# Altium schematic sheet MODULE_GND.SchDoc: MODULE GND
size A3; Author: Silvio Navaretti; CompanyName: ARDUINO; DrawnBy: Silvio Navaretti; Engineer: Silvio Navaretti; Organization: ARDUINO; SheetNumber: 10; SheetTotal: 51; RevAuthor: Silvio Navaretti
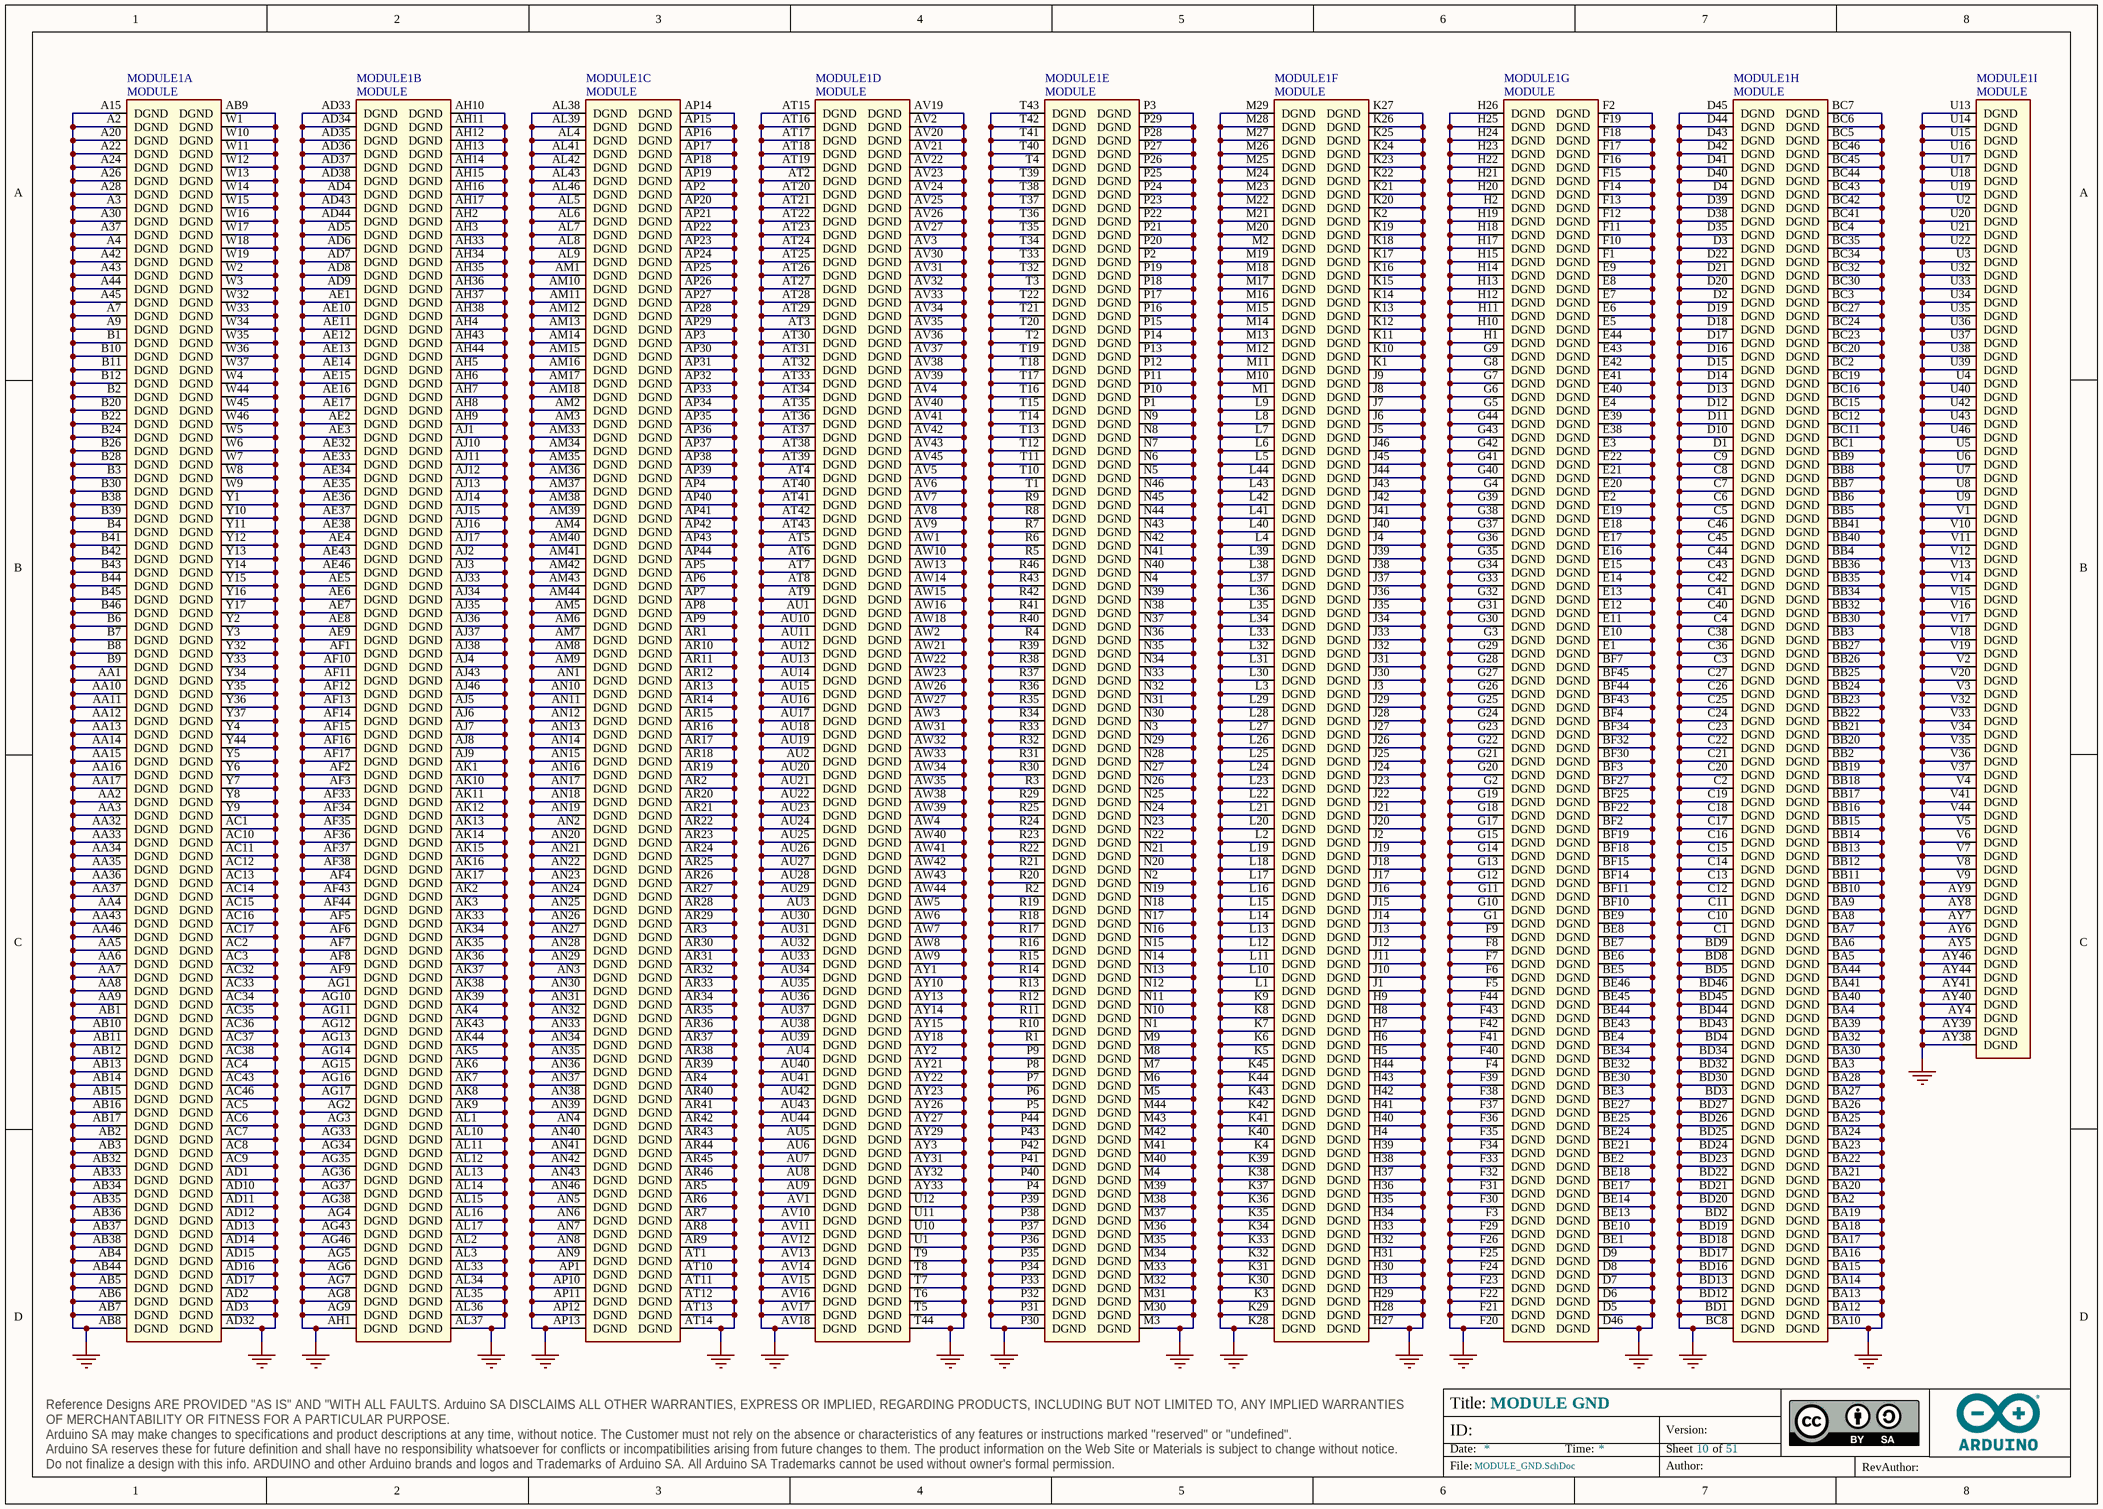
[diagram p0: MODULE_GND.SchDoc]

## Parts
MODULE1  MODULE  [MODULE]  (parts A,B,C,D,E,F,G,H,I of 22)

## Nets
GND: MODULE1.A2(DGND) MODULE1.A3(DGND) MODULE1.A4(DGND) MODULE1.A7(DGND) MODULE1.A9(DGND) MODULE1.A15(DGND) MODULE1.A20(DGND) MODULE1.A22(DGND) MODULE1.A24(DGND) MODULE1.A26(DGND) MODULE1.A28(DGND) MODULE1.A30(DGND) MODULE1.A37(DGND) MODULE1.A42(DGND) MODULE1.A43(DGND) MODULE1.A44(DGND) MODULE1.A45(DGND) MODULE1.AA1(DGND) MODULE1.AA2(DGND) MODULE1.AA3(DGND) MODULE1.AA4(DGND) MODULE1.AA5(DGND) MODULE1.AA6(DGND) MODULE1.AA7(DGND) MODULE1.AA8(DGND) MODULE1.AA9(DGND) MODULE1.AA10(DGND) MODULE1.AA11(DGND) MODULE1.AA12(DGND) MODULE1.AA13(DGND) MODULE1.AA14(DGND) MODULE1.AA15(DGND) MODULE1.AA16(DGND) MODULE1.AA17(DGND) MODULE1.AA32(DGND) MODULE1.AA33(DGND) MODULE1.AA34(DGND) MODULE1.AA35(DGND) MODULE1.AA36(DGND) MODULE1.AA37(DGND) MODULE1.AA43(DGND) MODULE1.AA46(DGND) MODULE1.AB1(DGND) MODULE1.AB2(DGND) MODULE1.AB3(DGND) MODULE1.AB4(DGND) MODULE1.AB5(DGND) MODULE1.AB6(DGND) MODULE1.AB7(DGND) MODULE1.AB8(DGND) MODULE1.AB9(DGND) MODULE1.AB10(DGND) MODULE1.AB11(DGND) MODULE1.AB12(DGND) MODULE1.AB13(DGND) MODULE1.AB14(DGND) MODULE1.AB15(DGND) MODULE1.AB16(DGND) MODULE1.AB17(DGND) MODULE1.AB32(DGND) MODULE1.AB33(DGND) MODULE1.AB34(DGND) MODULE1.AB35(DGND) MODULE1.AB36(DGND) MODULE1.AB37(DGND) MODULE1.AB38(DGND) MODULE1.AB44(DGND) MODULE1.AC1(DGND) MODULE1.AC2(DGND) MODULE1.AC3(DGND) MODULE1.AC4(DGND) MODULE1.AC5(DGND) MODULE1.AC6(DGND) MODULE1.AC7(DGND) MODULE1.AC8(DGND) MODULE1.AC9(DGND) MODULE1.AC10(DGND) MODULE1.AC11(DGND) MODULE1.AC12(DGND) MODULE1.AC13(DGND) MODULE1.AC14(DGND) MODULE1.AC15(DGND) MODULE1.AC16(DGND) MODULE1.AC17(DGND) MODULE1.AC32(DGND) MODULE1.AC33(DGND) MODULE1.AC34(DGND) MODULE1.AC35(DGND) MODULE1.AC36(DGND) MODULE1.AC37(DGND) MODULE1.AC38(DGND) MODULE1.AC43(DGND) MODULE1.AC46(DGND) MODULE1.AD1(DGND) MODULE1.AD2(DGND) MODULE1.AD3(DGND) MODULE1.AD4(DGND) MODULE1.AD5(DGND) MODULE1.AD6(DGND) MODULE1.AD7(DGND) MODULE1.AD8(DGND) MODULE1.AD9(DGND) MODULE1.AD10(DGND) MODULE1.AD11(DGND) MODULE1.AD12(DGND) MODULE1.AD13(DGND) MODULE1.AD14(DGND) MODULE1.AD15(DGND) MODULE1.AD16(DGND) MODULE1.AD17(DGND) MODULE1.AD32(DGND) MODULE1.AD33(DGND) MODULE1.AD34(DGND) MODULE1.AD35(DGND) MODULE1.AD36(DGND) MODULE1.AD37(DGND) MODULE1.AD38(DGND) MODULE1.AD43(DGND) MODULE1.AD44(DGND) MODULE1.AE1(DGND) MODULE1.AE2(DGND) MODULE1.AE3(DGND) MODULE1.AE4(DGND) MODULE1.AE5(DGND) MODULE1.AE6(DGND) MODULE1.AE7(DGND) MODULE1.AE8(DGND) MODULE1.AE9(DGND) MODULE1.AE10(DGND) MODULE1.AE11(DGND) MODULE1.AE12(DGND) MODULE1.AE13(DGND) MODULE1.AE14(DGND) MODULE1.AE15(DGND) MODULE1.AE16(DGND) MODULE1.AE17(DGND) MODULE1.AE32(DGND) MODULE1.AE33(DGND) MODULE1.AE34(DGND) MODULE1.AE35(DGND) MODULE1.AE36(DGND) MODULE1.AE37(DGND) MODULE1.AE38(DGND) MODULE1.AE43(DGND) MODULE1.AE46(DGND) MODULE1.AF1(DGND) MODULE1.AF2(DGND) MODULE1.AF3(DGND) MODULE1.AF4(DGND) MODULE1.AF5(DGND) MODULE1.AF6(DGND) MODULE1.AF7(DGND) MODULE1.AF8(DGND) MODULE1.AF9(DGND) MODULE1.AF10(DGND) MODULE1.AF11(DGND) MODULE1.AF12(DGND) MODULE1.AF13(DGND) MODULE1.AF14(DGND) MODULE1.AF15(DGND) MODULE1.AF16(DGND) MODULE1.AF17(DGND) MODULE1.AF33(DGND) MODULE1.AF34(DGND) MODULE1.AF35(DGND) MODULE1.AF36(DGND) MODULE1.AF37(DGND) MODULE1.AF38(DGND) MODULE1.AF43(DGND) MODULE1.AF44(DGND) MODULE1.AG1(DGND) MODULE1.AG2(DGND) MODULE1.AG3(DGND) MODULE1.AG4(DGND) MODULE1.AG5(DGND) MODULE1.AG6(DGND) MODULE1.AG7(DGND) MODULE1.AG8(DGND) MODULE1.AG9(DGND) MODULE1.AG10(DGND) MODULE1.AG11(DGND) MODULE1.AG12(DGND) MODULE1.AG13(DGND) MODULE1.AG14(DGND) MODULE1.AG15(DGND) MODULE1.AG16(DGND) MODULE1.AG17(DGND) MODULE1.AG33(DGND) MODULE1.AG34(DGND) MODULE1.AG35(DGND) MODULE1.AG36(DGND) MODULE1.AG37(DGND) MODULE1.AG38(DGND) MODULE1.AG43(DGND) MODULE1.AG46(DGND) MODULE1.AH1(DGND) MODULE1.AH2(DGND) MODULE1.AH3(DGND) MODULE1.AH4(DGND) MODULE1.AH5(DGND) MODULE1.AH6(DGND) MODULE1.AH7(DGND) MODULE1.AH8(DGND) MODULE1.AH9(DGND) MODULE1.AH10(DGND) MODULE1.AH11(DGND) MODULE1.AH12(DGND) MODULE1.AH13(DGND) MODULE1.AH14(DGND) MODULE1.AH15(DGND) MODULE1.AH16(DGND) MODULE1.AH17(DGND) MODULE1.AH33(DGND) MODULE1.AH34(DGND) MODULE1.AH35(DGND) MODULE1.AH36(DGND) MODULE1.AH37(DGND) MODULE1.AH38(DGND) MODULE1.AH43(DGND) MODULE1.AH44(DGND) MODULE1.AJ1(DGND) MODULE1.AJ2(DGND) MODULE1.AJ3(DGND) MODULE1.AJ4(DGND) MODULE1.AJ5(DGND) MODULE1.AJ6(DGND) MODULE1.AJ7(DGND) MODULE1.AJ8(DGND) MODULE1.AJ9(DGND) MODULE1.AJ10(DGND) MODULE1.AJ11(DGND) MODULE1.AJ12(DGND) MODULE1.AJ13(DGND) MODULE1.AJ14(DGND) MODULE1.AJ15(DGND) MODULE1.AJ16(DGND) MODULE1.AJ17(DGND) MODULE1.AJ33(DGND) MODULE1.AJ34(DGND) MODULE1.AJ35(DGND) MODULE1.AJ36(DGND) MODULE1.AJ37(DGND) MODULE1.AJ38(DGND) MODULE1.AJ43(DGND) MODULE1.AJ46(DGND) MODULE1.AK1(DGND) MODULE1.AK2(DGND) MODULE1.AK3(DGND) MODULE1.AK4(DGND) MODULE1.AK5(DGND) MODULE1.AK6(DGND) MODULE1.AK7(DGND) MODULE1.AK8(DGND) MODULE1.AK9(DGND) MODULE1.AK10(DGND) MODULE1.AK11(DGND) MODULE1.AK12(DGND) MODULE1.AK13(DGND) MODULE1.AK14(DGND) MODULE1.AK15(DGND) MODULE1.AK16(DGND) MODULE1.AK17(DGND) MODULE1.AK33(DGND) MODULE1.AK34(DGND) MODULE1.AK35(DGND) MODULE1.AK36(DGND) MODULE1.AK37(DGND) MODULE1.AK38(DGND) MODULE1.AK39(DGND) MODULE1.AK43(DGND) MODULE1.AK44(DGND) MODULE1.AL1(DGND) MODULE1.AL2(DGND) MODULE1.AL3(DGND) MODULE1.AL4(DGND) MODULE1.AL5(DGND) MODULE1.AL6(DGND) MODULE1.AL7(DGND) MODULE1.AL8(DGND) MODULE1.AL9(DGND) MODULE1.AL10(DGND) MODULE1.AL11(DGND) MODULE1.AL12(DGND) MODULE1.AL13(DGND) MODULE1.AL14(DGND) MODULE1.AL15(DGND) MODULE1.AL16(DGND) MODULE1.AL17(DGND) MODULE1.AL33(DGND) MODULE1.AL34(DGND) MODULE1.AL35(DGND) MODULE1.AL36(DGND) MODULE1.AL37(DGND) MODULE1.AL38(DGND) MODULE1.AL39(DGND) MODULE1.AL41(DGND) MODULE1.AL42(DGND) MODULE1.AL43(DGND) MODULE1.AL46(DGND) MODULE1.AM1(DGND) MODULE1.AM2(DGND) MODULE1.AM3(DGND) MODULE1.AM4(DGND) MODULE1.AM5(DGND) MODULE1.AM6(DGND) MODULE1.AM7(DGND) MODULE1.AM8(DGND) MODULE1.AM9(DGND) MODULE1.AM10(DGND) MODULE1.AM11(DGND) MODULE1.AM12(DGND) MODULE1.AM13(DGND) MODULE1.AM14(DGND) MODULE1.AM15(DGND) MODULE1.AM16(DGND) MODULE1.AM17(DGND) MODULE1.AM18(DGND) MODULE1.AM33(DGND) MODULE1.AM34(DGND) MODULE1.AM35(DGND) MODULE1.AM36(DGND) MODULE1.AM37(DGND) MODULE1.AM38(DGND) MODULE1.AM39(DGND) MODULE1.AM40(DGND) MODULE1.AM41(DGND) MODULE1.AM42(DGND) MODULE1.AM43(DGND) MODULE1.AM44(DGND) MODULE1.AN1(DGND) MODULE1.AN2(DGND) MODULE1.AN3(DGND) MODULE1.AN4(DGND) MODULE1.AN5(DGND) MODULE1.AN6(DGND) MODULE1.AN7(DGND) MODULE1.AN8(DGND) MODULE1.AN9(DGND) MODULE1.AN10(DGND) MODULE1.AN11(DGND) MODULE1.AN12(DGND) MODULE1.AN13(DGND) MODULE1.AN14(DGND) MODULE1.AN15(DGND) MODULE1.AN16(DGND) MODULE1.AN17(DGND) MODULE1.AN18(DGND) MODULE1.AN19(DGND) MODULE1.AN20(DGND) MODULE1.AN21(DGND) MODULE1.AN22(DGND) MODULE1.AN23(DGND) MODULE1.AN24(DGND) MODULE1.AN25(DGND) MODULE1.AN26(DGND) MODULE1.AN27(DGND) MODULE1.AN28(DGND) MODULE1.AN29(DGND) MODULE1.AN30(DGND) MODULE1.AN31(DGND) MODULE1.AN32(DGND) MODULE1.AN33(DGND) MODULE1.AN34(DGND) MODULE1.AN35(DGND) MODULE1.AN36(DGND) MODULE1.AN37(DGND) MODULE1.AN38(DGND) MODULE1.AN39(DGND) MODULE1.AN40(DGND) MODULE1.AN41(DGND) MODULE1.AN42(DGND) MODULE1.AN43(DGND) MODULE1.AN46(DGND) MODULE1.AP1(DGND) MODULE1.AP2(DGND) MODULE1.AP3(DGND) MODULE1.AP4(DGND) MODULE1.AP5(DGND) MODULE1.AP6(DGND) MODULE1.AP7(DGND) MODULE1.AP8(DGND) MODULE1.AP9(DGND) MODULE1.AP10(DGND) MODULE1.AP11(DGND) MODULE1.AP12(DGND) MODULE1.AP13(DGND) MODULE1.AP14(DGND) MODULE1.AP15(DGND) MODULE1.AP16(DGND) MODULE1.AP17(DGND) MODULE1.AP18(DGND) MODULE1.AP19(DGND) MODULE1.AP20(DGND) MODULE1.AP21(DGND) MODULE1.AP22(DGND) MODULE1.AP23(DGND) MODULE1.AP24(DGND) MODULE1.AP25(DGND) MODULE1.AP26(DGND) MODULE1.AP27(DGND) MODULE1.AP28(DGND) MODULE1.AP29(DGND) MODULE1.AP30(DGND) MODULE1.AP31(DGND) MODULE1.AP32(DGND) MODULE1.AP33(DGND) MODULE1.AP34(DGND) MODULE1.AP35(DGND) MODULE1.AP36(DGND) MODULE1.AP37(DGND) MODULE1.AP38(DGND) MODULE1.AP39(DGND) MODULE1.AP40(DGND) MODULE1.AP41(DGND) MODULE1.AP42(DGND) MODULE1.AP43(DGND) MODULE1.AP44(DGND) MODULE1.AR1(DGND) MODULE1.AR2(DGND) MODULE1.AR3(DGND) MODULE1.AR4(DGND) MODULE1.AR5(DGND) MODULE1.AR6(DGND) MODULE1.AR7(DGND) MODULE1.AR8(DGND) MODULE1.AR9(DGND) MODULE1.AR10(DGND) MODULE1.AR11(DGND) MODULE1.AR12(DGND) MODULE1.AR13(DGND) MODULE1.AR14(DGND) MODULE1.AR15(DGND) MODULE1.AR16(DGND) MODULE1.AR17(DGND) MODULE1.AR18(DGND) MODULE1.AR19(DGND) MODULE1.AR20(DGND) MODULE1.AR21(DGND) MODULE1.AR22(DGND) MODULE1.AR23(DGND) MODULE1.AR24(DGND) MODULE1.AR25(DGND) MODULE1.AR26(DGND) MODULE1.AR27(DGND) MODULE1.AR28(DGND) MODULE1.AR29(DGND) MODULE1.AR30(DGND) MODULE1.AR31(DGND) MODULE1.AR32(DGND) MODULE1.AR33(DGND) MODULE1.AR34(DGND) MODULE1.AR35(DGND) MODULE1.AR36(DGND) MODULE1.AR37(DGND) MODULE1.AR38(DGND) MODULE1.AR39(DGND) MODULE1.AR40(DGND) MODULE1.AR41(DGND) MODULE1.AR42(DGND) MODULE1.AR43(DGND) MODULE1.AR44(DGND) MODULE1.AR45(DGND) MODULE1.AR46(DGND) MODULE1.AT1(DGND) MODULE1.AT2(DGND) MODULE1.AT3(DGND) MODULE1.AT4(DGND) MODULE1.AT5(DGND) MODULE1.AT6(DGND) MODULE1.AT7(DGND) MODULE1.AT8(DGND) MODULE1.AT9(DGND) MODULE1.AT10(DGND) MODULE1.AT11(DGND) MODULE1.AT12(DGND) MODULE1.AT13(DGND) MODULE1.AT14(DGND) MODULE1.AT15(DGND) MODULE1.AT16(DGND) MODULE1.AT17(DGND) MODULE1.AT18(DGND) MODULE1.AT19(DGND) MODULE1.AT20(DGND) MODULE1.AT21(DGND) MODULE1.AT22(DGND) MODULE1.AT23(DGND) MODULE1.AT24(DGND) MODULE1.AT25(DGND) MODULE1.AT26(DGND) MODULE1.AT27(DGND) MODULE1.AT28(DGND) MODULE1.AT29(DGND) MODULE1.AT30(DGND) MODULE1.AT31(DGND) MODULE1.AT32(DGND) MODULE1.AT33(DGND) MODULE1.AT34(DGND) MODULE1.AT35(DGND) MODULE1.AT36(DGND) MODULE1.AT37(DGND) MODULE1.AT38(DGND) MODULE1.AT39(DGND) MODULE1.AT40(DGND) MODULE1.AT41(DGND) MODULE1.AT42(DGND) MODULE1.AT43(DGND) MODULE1.AU1(DGND) MODULE1.AU2(DGND) MODULE1.AU3(DGND) MODULE1.AU4(DGND) MODULE1.AU5(DGND) MODULE1.AU6(DGND) MODULE1.AU7(DGND) MODULE1.AU8(DGND) MODULE1.AU9(DGND) MODULE1.AU10(DGND) MODULE1.AU11(DGND) MODULE1.AU12(DGND) MODULE1.AU13(DGND) MODULE1.AU14(DGND) MODULE1.AU15(DGND) MODULE1.AU16(DGND) MODULE1.AU17(DGND) MODULE1.AU18(DGND) MODULE1.AU19(DGND) MODULE1.AU20(DGND) MODULE1.AU21(DGND) MODULE1.AU22(DGND) MODULE1.AU23(DGND) MODULE1.AU24(DGND) MODULE1.AU25(DGND) MODULE1.AU26(DGND) MODULE1.AU27(DGND) MODULE1.AU28(DGND) MODULE1.AU29(DGND) MODULE1.AU30(DGND) MODULE1.AU31(DGND) MODULE1.AU32(DGND) MODULE1.AU33(DGND) MODULE1.AU34(DGND) MODULE1.AU35(DGND) MODULE1.AU36(DGND) MODULE1.AU37(DGND) MODULE1.AU38(DGND) MODULE1.AU39(DGND) MODULE1.AU40(DGND) MODULE1.AU41(DGND) MODULE1.AU42(DGND) MODULE1.AU43(DGND) MODULE1.AU44(DGND) MODULE1.AV1(DGND) MODULE1.AV2(DGND) MODULE1.AV3(DGND) MODULE1.AV4(DGND) MODULE1.AV5(DGND) MODULE1.AV6(DGND) MODULE1.AV7(DGND) MODULE1.AV8(DGND) MODULE1.AV9(DGND) MODULE1.AV10(DGND) MODULE1.AV11(DGND) MODULE1.AV12(DGND) MODULE1.AV13(DGND) MODULE1.AV14(DGND) MODULE1.AV15(DGND) MODULE1.AV16(DGND) MODULE1.AV17(DGND) MODULE1.AV18(DGND) MODULE1.AV19(DGND) MODULE1.AV20(DGND) MODULE1.AV21(DGND) MODULE1.AV22(DGND) MODULE1.AV23(DGND) MODULE1.AV24(DGND) MODULE1.AV25(DGND) MODULE1.AV26(DGND) MODULE1.AV27(DGND) MODULE1.AV30(DGND) MODULE1.AV31(DGND) MODULE1.AV32(DGND) MODULE1.AV33(DGND) MODULE1.AV34(DGND) MODULE1.AV35(DGND) MODULE1.AV36(DGND) MODULE1.AV37(DGND) MODULE1.AV38(DGND) MODULE1.AV39(DGND) MODULE1.AV40(DGND) MODULE1.AV41(DGND) MODULE1.AV42(DGND) MODULE1.AV43(DGND) MODULE1.AV45(DGND) MODULE1.AW1(DGND) MODULE1.AW2(DGND) MODULE1.AW3(DGND) MODULE1.AW4(DGND) MODULE1.AW5(DGND) MODULE1.AW6(DGND) MODULE1.AW7(DGND) MODULE1.AW8(DGND) MODULE1.AW9(DGND) MODULE1.AW10(DGND) MODULE1.AW13(DGND) MODULE1.AW14(DGND) MODULE1.AW15(DGND) MODULE1.AW16(DGND) MODULE1.AW18(DGND) MODULE1.AW21(DGND) MODULE1.AW22(DGND) MODULE1.AW23(DGND) MODULE1.AW26(DGND) MODULE1.AW27(DGND) MODULE1.AW31(DGND) MODULE1.AW32(DGND) MODULE1.AW33(DGND) MODULE1.AW34(DGND) MODULE1.AW35(DGND) MODULE1.AW38(DGND) MODULE1.AW39(DGND) MODULE1.AW40(DGND) MODULE1.AW41(DGND) MODULE1.AW42(DGND) MODULE1.AW43(DGND) MODULE1.AW44(DGND) MODULE1.AY1(DGND) MODULE1.AY2(DGND) MODULE1.AY3(DGND) MODULE1.AY4(DGND) MODULE1.AY5(DGND) MODULE1.AY6(DGND) MODULE1.AY7(DGND) MODULE1.AY8(DGND) MODULE1.AY9(DGND) MODULE1.AY10(DGND) MODULE1.AY13(DGND) MODULE1.AY14(DGND) MODULE1.AY15(DGND) MODULE1.AY18(DGND) MODULE1.AY21(DGND) MODULE1.AY22(DGND) MODULE1.AY23(DGND) MODULE1.AY26(DGND) MODULE1.AY27(DGND) MODULE1.AY29(DGND) MODULE1.AY31(DGND) MODULE1.AY32(DGND) MODULE1.AY33(DGND) MODULE1.AY38(DGND) MODULE1.AY39(DGND) MODULE1.AY40(DGND) MODULE1.AY41(DGND) MODULE1.AY44(DGND) MODULE1.AY46(DGND) MODULE1.B1(DGND) MODULE1.B2(DGND) MODULE1.B3(DGND) MODULE1.B4(DGND) MODULE1.B6(DGND) MODULE1.B7(DGND) MODULE1.B8(DGND) MODULE1.B9(DGND) MODULE1.B10(DGND) MODULE1.B11(DGND) MODULE1.B12(DGND) MODULE1.B20(DGND) MODULE1.B22(DGND) MODULE1.B24(DGND) MODULE1.B26(DGND) MODULE1.B28(DGND) MODULE1.B30(DGND) MODULE1.B38(DGND) MODULE1.B39(DGND) MODULE1.B41(DGND) MODULE1.B42(DGND) MODULE1.B43(DGND) MODULE1.B44(DGND) MODULE1.B45(DGND) MODULE1.B46(DGND) MODULE1.BA2(DGND) MODULE1.BA3(DGND) MODULE1.BA4(DGND) MODULE1.BA5(DGND) MODULE1.BA6(DGND) MODULE1.BA7(DGND) MODULE1.BA8(DGND) MODULE1.BA9(DGND) MODULE1.BA10(DGND) MODULE1.BA12(DGND) MODULE1.BA13(DGND) MODULE1.BA14(DGND) MODULE1.BA15(DGND) MODULE1.BA16(DGND) MODULE1.BA17(DGND) MODULE1.BA18(DGND) MODULE1.BA19(DGND) MODULE1.BA20(DGND) MODULE1.BA21(DGND) MODULE1.BA22(DGND) MODULE1.BA23(DGND) MODULE1.BA24(DGND) MODULE1.BA25(DGND) MODULE1.BA26(DGND) MODULE1.BA27(DGND) MODULE1.BA28(DGND) MODULE1.BA30(DGND) MODULE1.BA32(DGND) MODULE1.BA39(DGND) MODULE1.BA40(DGND) MODULE1.BA41(DGND) MODULE1.BA44(DGND) MODULE1.BB2(DGND) MODULE1.BB3(DGND) MODULE1.BB4(DGND) MODULE1.BB5(DGND) MODULE1.BB6(DGND) MODULE1.BB7(DGND) MODULE1.BB8(DGND) MODULE1.BB9(DGND) MODULE1.BB10(DGND) MODULE1.BB11(DGND) MODULE1.BB12(DGND) MODULE1.BB13(DGND) MODULE1.BB14(DGND) MODULE1.BB15(DGND) MODULE1.BB16(DGND) MODULE1.BB17(DGND) MODULE1.BB18(DGND) MODULE1.BB19(DGND) MODULE1.BB20(DGND) MODULE1.BB21(DGND) MODULE1.BB22(DGND) MODULE1.BB23(DGND) MODULE1.BB24(DGND) MODULE1.BB25(DGND) MODULE1.BB26(DGND) MODULE1.BB27(DGND) MODULE1.BB30(DGND) MODULE1.BB32(DGND) MODULE1.BB34(DGND) MODULE1.BB35(DGND) MODULE1.BB36(DGND) MODULE1.BB40(DGND) MODULE1.BB41(DGND) MODULE1.BC1(DGND) MODULE1.BC2(DGND) MODULE1.BC3(DGND) MODULE1.BC4(DGND) MODULE1.BC5(DGND) MODULE1.BC6(DGND) MODULE1.BC7(DGND) MODULE1.BC8(DGND) MODULE1.BC11(DGND) MODULE1.BC12(DGND) MODULE1.BC15(DGND) MODULE1.BC16(DGND) MODULE1.BC19(DGND) MODULE1.BC20(DGND) MODULE1.BC23(DGND) MODULE1.BC24(DGND) MODULE1.BC27(DGND) MODULE1.BC30(DGND) MODULE1.BC32(DGND) MODULE1.BC34(DGND) MODULE1.BC35(DGND) MODULE1.BC41(DGND) MODULE1.BC42(DGND) MODULE1.BC43(DGND) MODULE1.BC44(DGND) MODULE1.BC45(DGND) MODULE1.BC46(DGND) MODULE1.BD1(DGND) MODULE1.BD2(DGND) MODULE1.BD3(DGND) MODULE1.BD4(DGND) MODULE1.BD5(DGND) MODULE1.BD8(DGND) MODULE1.BD9(DGND) MODULE1.BD12(DGND) MODULE1.BD13(DGND) MODULE1.BD16(DGND) MODULE1.BD17(DGND) MODULE1.BD18(DGND) MODULE1.BD19(DGND) MODULE1.BD20(DGND) MODULE1.BD21(DGND) MODULE1.BD22(DGND) MODULE1.BD23(DGND) MODULE1.BD24(DGND) MODULE1.BD25(DGND) MODULE1.BD26(DGND) MODULE1.BD27(DGND) MODULE1.BD30(DGND) MODULE1.BD32(DGND) MODULE1.BD34(DGND) MODULE1.BD43(DGND) MODULE1.BD44(DGND) MODULE1.BD45(DGND) MODULE1.BD46(DGND) MODULE1.BE1(DGND) MODULE1.BE2(DGND) MODULE1.BE3(DGND) MODULE1.BE4(DGND) MODULE1.BE5(DGND) MODULE1.BE6(DGND) MODULE1.BE7(DGND) MODULE1.BE8(DGND) MODULE1.BE9(DGND) MODULE1.BE10(DGND) MODULE1.BE13(DGND) MODULE1.BE14(DGND) MODULE1.BE17(DGND) MODULE1.BE18(DGND) MODULE1.BE21(DGND) MODULE1.BE24(DGND) MODULE1.BE25(DGND) MODULE1.BE27(DGND) MODULE1.BE30(DGND) MODULE1.BE32(DGND) MODULE1.BE34(DGND) MODULE1.BE43(DGND) MODULE1.BE44(DGND) MODULE1.BE45(DGND) MODULE1.BE46(DGND) MODULE1.BF2(DGND) MODULE1.BF3(DGND) MODULE1.BF4(DGND) MODULE1.BF7(DGND) MODULE1.BF10(DGND) MODULE1.BF11(DGND) MODULE1.BF14(DGND) MODULE1.BF15(DGND) MODULE1.BF18(DGND) MODULE1.BF19(DGND) MODULE1.BF22(DGND) MODULE1.BF25(DGND) MODULE1.BF27(DGND) MODULE1.BF30(DGND) MODULE1.BF32(DGND) MODULE1.BF34(DGND) MODULE1.BF43(DGND) MODULE1.BF44(DGND) MODULE1.BF45(DGND) MODULE1.C1(DGND) MODULE1.C2(DGND) MODULE1.C3(DGND) MODULE1.C4(DGND) MODULE1.C5(DGND) MODULE1.C6(DGND) MODULE1.C7(DGND) MODULE1.C8(DGND) MODULE1.C9(DGND) MODULE1.C10(DGND) MODULE1.C11(DGND) MODULE1.C12(DGND) MODULE1.C13(DGND) MODULE1.C14(DGND) MODULE1.C15(DGND) MODULE1.C16(DGND) MODULE1.C17(DGND) MODULE1.C18(DGND) MODULE1.C19(DGND) MODULE1.C20(DGND) MODULE1.C21(DGND) MODULE1.C22(DGND) MODULE1.C23(DGND) MODULE1.C24(DGND) MODULE1.C25(DGND) MODULE1.C26(DGND) MODULE1.C27(DGND) MODULE1.C36(DGND) MODULE1.C38(DGND) MODULE1.C40(DGND) MODULE1.C41(DGND) MODULE1.C42(DGND) MODULE1.C43(DGND) MODULE1.C44(DGND) MODULE1.C45(DGND) MODULE1.C46(DGND) MODULE1.D1(DGND) MODULE1.D2(DGND) MODULE1.D3(DGND) MODULE1.D4(DGND) MODULE1.D5(DGND) MODULE1.D6(DGND) MODULE1.D7(DGND) MODULE1.D8(DGND) MODULE1.D9(DGND) MODULE1.D10(DGND) MODULE1.D11(DGND) MODULE1.D12(DGND) MODULE1.D13(DGND) MODULE1.D14(DGND) MODULE1.D15(DGND) MODULE1.D16(DGND) MODULE1.D17(DGND) MODULE1.D18(DGND) MODULE1.D19(DGND) MODULE1.D20(DGND) MODULE1.D21(DGND) MODULE1.D22(DGND) MODULE1.D35(DGND) MODULE1.D38(DGND) MODULE1.D39(DGND) MODULE1.D40(DGND) MODULE1.D41(DGND) MODULE1.D42(DGND) MODULE1.D43(DGND) MODULE1.D44(DGND) MODULE1.D45(DGND) MODULE1.D46(DGND) MODULE1.E1(DGND) MODULE1.E2(DGND) MODULE1.E3(DGND) MODULE1.E4(DGND) MODULE1.E5(DGND) MODULE1.E6(DGND) MODULE1.E7(DGND) MODULE1.E8(DGND) MODULE1.E9(DGND) MODULE1.E10(DGND) MODULE1.E11(DGND) MODULE1.E12(DGND) MODULE1.E13(DGND) MODULE1.E14(DGND) MODULE1.E15(DGND) MODULE1.E16(DGND) MODULE1.E17(DGND) MODULE1.E18(DGND) MODULE1.E19(DGND) MODULE1.E20(DGND) MODULE1.E21(DGND) MODULE1.E22(DGND) MODULE1.E38(DGND) MODULE1.E39(DGND) MODULE1.E40(DGND) MODULE1.E41(DGND) MODULE1.E42(DGND) MODULE1.E43(DGND) MODULE1.E44(DGND) MODULE1.F1(DGND) MODULE1.F2(DGND) MODULE1.F3(DGND) MODULE1.F4(DGND) MODULE1.F5(DGND) MODULE1.F6(DGND) MODULE1.F7(DGND) MODULE1.F8(DGND) MODULE1.F9(DGND) MODULE1.F10(DGND) MODULE1.F11(DGND) MODULE1.F12(DGND) MODULE1.F13(DGND) MODULE1.F14(DGND) MODULE1.F15(DGND) MODULE1.F16(DGND) MODULE1.F17(DGND) MODULE1.F18(DGND) MODULE1.F19(DGND) MODULE1.F20(DGND) MODULE1.F21(DGND) MODULE1.F22(DGND) MODULE1.F23(DGND) MODULE1.F24(DGND) MODULE1.F25(DGND) MODULE1.F26(DGND) MODULE1.F29(DGND) MODULE1.F30(DGND) MODULE1.F31(DGND) MODULE1.F32(DGND) MODULE1.F33(DGND) MODULE1.F34(DGND) MODULE1.F35(DGND) MODULE1.F36(DGND) MODULE1.F37(DGND) MODULE1.F38(DGND) MODULE1.F39(DGND) MODULE1.F40(DGND) MODULE1.F41(DGND) MODULE1.F42(DGND) MODULE1.F43(DGND) MODULE1.F44(DGND) MODULE1.G1(DGND) MODULE1.G2(DGND) MODULE1.G3(DGND) MODULE1.G4(DGND) MODULE1.G5(DGND) MODULE1.G6(DGND) MODULE1.G7(DGND) MODULE1.G8(DGND) MODULE1.G9(DGND) MODULE1.G10(DGND) MODULE1.G11(DGND) MODULE1.G12(DGND) MODULE1.G13(DGND) MODULE1.G14(DGND) MODULE1.G15(DGND) MODULE1.G17(DGND) MODULE1.G18(DGND) MODULE1.G19(DGND) MODULE1.G20(DGND) MODULE1.G21(DGND) MODULE1.G22(DGND) MODULE1.G23(DGND) MODULE1.G24(DGND) MODULE1.G25(DGND) MODULE1.G26(DGND) MODULE1.G27(DGND) MODULE1.G28(DGND) MODULE1.G29(DGND) MODULE1.G30(DGND) MODULE1.G31(DGND) MODULE1.G32(DGND) MODULE1.G33(DGND) MODULE1.G34(DGND) MODULE1.G35(DGND) MODULE1.G36(DGND) MODULE1.G37(DGND) MODULE1.G38(DGND) MODULE1.G39(DGND) MODULE1.G40(DGND) MODULE1.G41(DGND) MODULE1.G42(DGND) MODULE1.G43(DGND) MODULE1.G44(DGND) MODULE1.H1(DGND) MODULE1.H2(DGND) MODULE1.H3(DGND) MODULE1.H4(DGND) MODULE1.H5(DGND) MODULE1.H6(DGND) MODULE1.H7(DGND) MODULE1.H8(DGND) MODULE1.H9(DGND) MODULE1.H10(DGND) MODULE1.H11(DGND) MODULE1.H12(DGND) MODULE1.H13(DGND) MODULE1.H14(DGND) MODULE1.H15(DGND) MODULE1.H17(DGND) MODULE1.H18(DGND) MODULE1.H19(DGND) MODULE1.H20(DGND) MODULE1.H21(DGND) MODULE1.H22(DGND) MODULE1.H23(DGND) MODULE1.H24(DGND) MODULE1.H25(DGND) MODULE1.H26(DGND) MODULE1.H27(DGND) MODULE1.H28(DGND) MODULE1.H29(DGND) MODULE1.H30(DGND) MODULE1.H31(DGND) MODULE1.H32(DGND) MODULE1.H33(DGND) MODULE1.H34(DGND) MODULE1.H35(DGND) MODULE1.H36(DGND) MODULE1.H37(DGND) MODULE1.H38(DGND) MODULE1.H39(DGND) MODULE1.H40(DGND) MODULE1.H41(DGND) MODULE1.H42(DGND) MODULE1.H43(DGND) MODULE1.H44(DGND) MODULE1.J1(DGND) MODULE1.J2(DGND) MODULE1.J3(DGND) MODULE1.J4(DGND) MODULE1.J5(DGND) MODULE1.J6(DGND) MODULE1.J7(DGND) MODULE1.J8(DGND) MODULE1.J9(DGND) MODULE1.J10(DGND) MODULE1.J11(DGND) MODULE1.J12(DGND) MODULE1.J13(DGND) MODULE1.J14(DGND) MODULE1.J15(DGND) MODULE1.J16(DGND) MODULE1.J17(DGND) MODULE1.J18(DGND) MODULE1.J19(DGND) MODULE1.J20(DGND) MODULE1.J21(DGND) MODULE1.J22(DGND) MODULE1.J23(DGND) MODULE1.J24(DGND) MODULE1.J25(DGND) MODULE1.J26(DGND) MODULE1.J27(DGND) MODULE1.J28(DGND) MODULE1.J29(DGND) MODULE1.J30(DGND) MODULE1.J31(DGND) MODULE1.J32(DGND) MODULE1.J33(DGND) MODULE1.J34(DGND) MODULE1.J35(DGND) MODULE1.J36(DGND) MODULE1.J37(DGND) MODULE1.J38(DGND) MODULE1.J39(DGND) MODULE1.J40(DGND) MODULE1.J41(DGND) MODULE1.J42(DGND) MODULE1.J43(DGND) MODULE1.J44(DGND) MODULE1.J45(DGND) MODULE1.J46(DGND) MODULE1.K1(DGND) MODULE1.K2(DGND) MODULE1.K3(DGND) MODULE1.K4(DGND) MODULE1.K5(DGND) MODULE1.K6(DGND) MODULE1.K7(DGND) MODULE1.K8(DGND) MODULE1.K9(DGND) MODULE1.K10(DGND) MODULE1.K11(DGND) MODULE1.K12(DGND) MODULE1.K13(DGND) MODULE1.K14(DGND) MODULE1.K15(DGND) MODULE1.K16(DGND) MODULE1.K17(DGND) MODULE1.K18(DGND) MODULE1.K19(DGND) MODULE1.K20(DGND) MODULE1.K21(DGND) MODULE1.K22(DGND) MODULE1.K23(DGND) MODULE1.K24(DGND) MODULE1.K25(DGND) MODULE1.K26(DGND) MODULE1.K27(DGND) MODULE1.K28(DGND) MODULE1.K29(DGND) MODULE1.K30(DGND) MODULE1.K31(DGND) MODULE1.K32(DGND) MODULE1.K33(DGND) MODULE1.K34(DGND) MODULE1.K35(DGND) MODULE1.K36(DGND) MODULE1.K37(DGND) MODULE1.K38(DGND) MODULE1.K39(DGND) MODULE1.K40(DGND) MODULE1.K41(DGND) MODULE1.K42(DGND) MODULE1.K43(DGND) MODULE1.K44(DGND) MODULE1.K45(DGND) MODULE1.L1(DGND) MODULE1.L2(DGND) MODULE1.L3(DGND) MODULE1.L4(DGND) MODULE1.L5(DGND) MODULE1.L6(DGND) MODULE1.L7(DGND) MODULE1.L8(DGND) MODULE1.L9(DGND) MODULE1.L10(DGND) MODULE1.L11(DGND) MODULE1.L12(DGND) MODULE1.L13(DGND) MODULE1.L14(DGND) MODULE1.L15(DGND) MODULE1.L16(DGND) MODULE1.L17(DGND) MODULE1.L18(DGND) MODULE1.L19(DGND) MODULE1.L20(DGND) MODULE1.L21(DGND) MODULE1.L22(DGND) MODULE1.L23(DGND) MODULE1.L24(DGND) MODULE1.L25(DGND) MODULE1.L26(DGND) MODULE1.L27(DGND) MODULE1.L28(DGND) MODULE1.L29(DGND) MODULE1.L30(DGND) MODULE1.L31(DGND) MODULE1.L32(DGND) MODULE1.L33(DGND) MODULE1.L34(DGND) MODULE1.L35(DGND) MODULE1.L36(DGND) MODULE1.L37(DGND) MODULE1.L38(DGND) MODULE1.L39(DGND) MODULE1.L40(DGND) MODULE1.L41(DGND) MODULE1.L42(DGND) MODULE1.L43(DGND) MODULE1.L44(DGND) MODULE1.M1(DGND) MODULE1.M2(DGND) MODULE1.M3(DGND) MODULE1.M4(DGND) MODULE1.M5(DGND) MODULE1.M6(DGND) MODULE1.M7(DGND) MODULE1.M8(DGND) MODULE1.M9(DGND) MODULE1.M10(DGND) MODULE1.M11(DGND) MODULE1.M12(DGND) MODULE1.M13(DGND) MODULE1.M14(DGND) MODULE1.M15(DGND) MODULE1.M16(DGND) MODULE1.M17(DGND) MODULE1.M18(DGND) MODULE1.M19(DGND) MODULE1.M20(DGND) MODULE1.M21(DGND) MODULE1.M22(DGND) MODULE1.M23(DGND) MODULE1.M24(DGND) MODULE1.M25(DGND) MODULE1.M26(DGND) MODULE1.M27(DGND) MODULE1.M28(DGND) MODULE1.M29(DGND) MODULE1.M30(DGND) MODULE1.M31(DGND) MODULE1.M32(DGND) MODULE1.M33(DGND) MODULE1.M34(DGND) MODULE1.M35(DGND) MODULE1.M36(DGND) MODULE1.M37(DGND) MODULE1.M38(DGND) MODULE1.M39(DGND) MODULE1.M40(DGND) MODULE1.M41(DGND) MODULE1.M42(DGND) MODULE1.M43(DGND) MODULE1.M44(DGND) MODULE1.N1(DGND) MODULE1.N2(DGND) MODULE1.N3(DGND) MODULE1.N4(DGND) MODULE1.N5(DGND) MODULE1.N6(DGND) MODULE1.N7(DGND) MODULE1.N8(DGND) MODULE1.N9(DGND) MODULE1.N10(DGND) MODULE1.N11(DGND) MODULE1.N12(DGND) MODULE1.N13(DGND) MODULE1.N14(DGND) MODULE1.N15(DGND) MODULE1.N16(DGND) MODULE1.N17(DGND) MODULE1.N18(DGND) MODULE1.N19(DGND) MODULE1.N20(DGND) MODULE1.N21(DGND) MODULE1.N22(DGND) MODULE1.N23(DGND) MODULE1.N24(DGND) MODULE1.N25(DGND) MODULE1.N26(DGND) MODULE1.N27(DGND) MODULE1.N28(DGND) MODULE1.N29(DGND) MODULE1.N30(DGND) MODULE1.N31(DGND) MODULE1.N32(DGND) MODULE1.N33(DGND) MODULE1.N34(DGND) MODULE1.N35(DGND) MODULE1.N36(DGND) MODULE1.N37(DGND) MODULE1.N38(DGND) MODULE1.N39(DGND) MODULE1.N40(DGND) MODULE1.N41(DGND) MODULE1.N42(DGND) MODULE1.N43(DGND) MODULE1.N44(DGND) MODULE1.N45(DGND) MODULE1.N46(DGND) MODULE1.P1(DGND) MODULE1.P2(DGND) MODULE1.P3(DGND) MODULE1.P4(DGND) MODULE1.P5(DGND) MODULE1.P6(DGND) MODULE1.P7(DGND) MODULE1.P8(DGND) MODULE1.P9(DGND) MODULE1.P10(DGND) MODULE1.P11(DGND) MODULE1.P12(DGND) MODULE1.P13(DGND) MODULE1.P14(DGND) MODULE1.P15(DGND) MODULE1.P16(DGND) MODULE1.P17(DGND) MODULE1.P18(DGND) MODULE1.P19(DGND) MODULE1.P20(DGND) MODULE1.P21(DGND) MODULE1.P22(DGND) MODULE1.P23(DGND) MODULE1.P24(DGND) MODULE1.P25(DGND) MODULE1.P26(DGND) MODULE1.P27(DGND) MODULE1.P28(DGND) MODULE1.P29(DGND) MODULE1.P30(DGND) MODULE1.P31(DGND) MODULE1.P32(DGND) MODULE1.P33(DGND) MODULE1.P34(DGND) MODULE1.P35(DGND) MODULE1.P36(DGND) MODULE1.P37(DGND) MODULE1.P38(DGND) MODULE1.P39(DGND) MODULE1.P40(DGND) MODULE1.P41(DGND) MODULE1.P42(DGND) MODULE1.P43(DGND) MODULE1.P44(DGND) MODULE1.R1(DGND) MODULE1.R2(DGND) MODULE1.R3(DGND) MODULE1.R4(DGND) MODULE1.R5(DGND) MODULE1.R6(DGND) MODULE1.R7(DGND) MODULE1.R8(DGND) MODULE1.R9(DGND) MODULE1.R10(DGND) MODULE1.R11(DGND) MODULE1.R12(DGND) MODULE1.R13(DGND) MODULE1.R14(DGND) MODULE1.R15(DGND) MODULE1.R16(DGND) MODULE1.R17(DGND) MODULE1.R18(DGND) MODULE1.R19(DGND) MODULE1.R20(DGND) MODULE1.R21(DGND) MODULE1.R22(DGND) MODULE1.R23(DGND) MODULE1.R24(DGND) MODULE1.R25(DGND) MODULE1.R29(DGND) MODULE1.R30(DGND) MODULE1.R31(DGND) MODULE1.R32(DGND) MODULE1.R33(DGND) MODULE1.R34(DGND) MODULE1.R35(DGND) MODULE1.R36(DGND) MODULE1.R37(DGND) MODULE1.R38(DGND) MODULE1.R39(DGND) MODULE1.R40(DGND) MODULE1.R41(DGND) MODULE1.R42(DGND) MODULE1.R43(DGND) MODULE1.R46(DGND) MODULE1.T1(DGND) MODULE1.T2(DGND) MODULE1.T3(DGND) MODULE1.T4(DGND) MODULE1.T5(DGND) MODULE1.T6(DGND) MODULE1.T7(DGND) MODULE1.T8(DGND) MODULE1.T9(DGND) MODULE1.T10(DGND) MODULE1.T11(DGND) MODULE1.T12(DGND) MODULE1.T13(DGND) MODULE1.T14(DGND) MODULE1.T15(DGND) MODULE1.T16(DGND) MODULE1.T17(DGND) MODULE1.T18(DGND) MODULE1.T19(DGND) MODULE1.T20(DGND) MODULE1.T21(DGND) MODULE1.T22(DGND) MODULE1.T32(DGND) MODULE1.T33(DGND) MODULE1.T34(DGND) MODULE1.T35(DGND) MODULE1.T36(DGND) MODULE1.T37(DGND) MODULE1.T38(DGND) MODULE1.T39(DGND) MODULE1.T40(DGND) MODULE1.T41(DGND) MODULE1.T42(DGND) MODULE1.T43(DGND) MODULE1.T44(DGND) MODULE1.U1(DGND) MODULE1.U2(DGND) MODULE1.U3(DGND) MODULE1.U4(DGND) MODULE1.U5(DGND) MODULE1.U6(DGND) MODULE1.U7(DGND) MODULE1.U8(DGND) MODULE1.U9(DGND) MODULE1.U10(DGND) MODULE1.U11(DGND) MODULE1.U12(DGND) MODULE1.U13(DGND) MODULE1.U14(DGND) MODULE1.U15(DGND) MODULE1.U16(DGND) MODULE1.U17(DGND) MODULE1.U18(DGND) MODULE1.U19(DGND) MODULE1.U20(DGND) MODULE1.U21(DGND) MODULE1.U22(DGND) MODULE1.U32(DGND) MODULE1.U33(DGND) MODULE1.U34(DGND) MODULE1.U35(DGND) MODULE1.U36(DGND) MODULE1.U37(DGND) MODULE1.U38(DGND) MODULE1.U39(DGND) MODULE1.U40(DGND) MODULE1.U42(DGND) MODULE1.U43(DGND) MODULE1.U46(DGND) MODULE1.V1(DGND) MODULE1.V2(DGND) MODULE1.V3(DGND) MODULE1.V4(DGND) MODULE1.V5(DGND) MODULE1.V6(DGND) MODULE1.V7(DGND) MODULE1.V8(DGND) MODULE1.V9(DGND) MODULE1.V10(DGND) MODULE1.V11(DGND) MODULE1.V12(DGND) MODULE1.V13(DGND) MODULE1.V14(DGND) MODULE1.V15(DGND) MODULE1.V16(DGND) MODULE1.V17(DGND) MODULE1.V18(DGND) MODULE1.V19(DGND) MODULE1.V20(DGND) MODULE1.V32(DGND) MODULE1.V33(DGND) MODULE1.V34(DGND) MODULE1.V35(DGND) MODULE1.V36(DGND) MODULE1.V37(DGND) MODULE1.V41(DGND) MODULE1.V44(DGND) MODULE1.W1(DGND) MODULE1.W2(DGND) MODULE1.W3(DGND) MODULE1.W4(DGND) MODULE1.W5(DGND) MODULE1.W6(DGND) MODULE1.W7(DGND) MODULE1.W8(DGND) MODULE1.W9(DGND) MODULE1.W10(DGND) MODULE1.W11(DGND) MODULE1.W12(DGND) MODULE1.W13(DGND) MODULE1.W14(DGND) MODULE1.W15(DGND) MODULE1.W16(DGND) MODULE1.W17(DGND) MODULE1.W18(DGND) MODULE1.W19(DGND) MODULE1.W32(DGND) MODULE1.W33(DGND) MODULE1.W34(DGND) MODULE1.W35(DGND) MODULE1.W36(DGND) MODULE1.W37(DGND) MODULE1.W44(DGND) MODULE1.W45(DGND) MODULE1.W46(DGND) MODULE1.Y1(DGND) MODULE1.Y2(DGND) MODULE1.Y3(DGND) MODULE1.Y4(DGND) MODULE1.Y5(DGND) MODULE1.Y6(DGND) MODULE1.Y7(DGND) MODULE1.Y8(DGND) MODULE1.Y9(DGND) MODULE1.Y10(DGND) MODULE1.Y11(DGND) MODULE1.Y12(DGND) MODULE1.Y13(DGND) MODULE1.Y14(DGND) MODULE1.Y15(DGND) MODULE1.Y16(DGND) MODULE1.Y17(DGND) MODULE1.Y32(DGND) MODULE1.Y33(DGND) MODULE1.Y34(DGND) MODULE1.Y35(DGND) MODULE1.Y36(DGND) MODULE1.Y37(DGND) MODULE1.Y44(DGND)

## Notes on the sheet
- Title:
- ID:
- Date:
- Time:
- Version:
- Sheet
- of
- RevAuthor:
- Reference Designs ARE PROVIDED "AS IS" AND "WITH ALL FAULTS. Arduino SA DISCLAIMS ALL OTHER WARRANTIES, EXPRESS OR IMPLIED, REGARDING PRODUCTS, INCLUDING BUT NOT LIMITED TO, ANY IMPLIED WARRANTIES OF MERCHANTABILITY OR FITNESS FOR A PARTICULAR PURPOSE.
  Arduino SA may make changes to specifications and product descriptions at any time, without notice. The Customer must not rely on the absence or characteristics of any features or instructions marked "reserved" or "undefined".
  Arduino SA reserves these for future definition and shall have no responsibility whatsoever for conflicts or incompatibilities arising from future changes to them. The product information on the Web Site or Materials is subject to change without notice.
  Do not finalize a design with this info. ARDUINO and other Arduino brands and logos and Trademarks of Arduino SA. All Arduino SA Trademarks cannot be used without owner's formal permission.
- File:
- Author:

## Library data of the parts
MODULE1 = M0029-A.19: MODULE BGA 1883 balls 57.5x57.5mm; Manufacturer: Qualcomm; Code Arduino: M0029; Part Number: MODULE BGA; Pin Count: 1883